# Altium schematic sheet Main.SchDoc
size A2; SheetNumber: 1; SheetTotal: 3
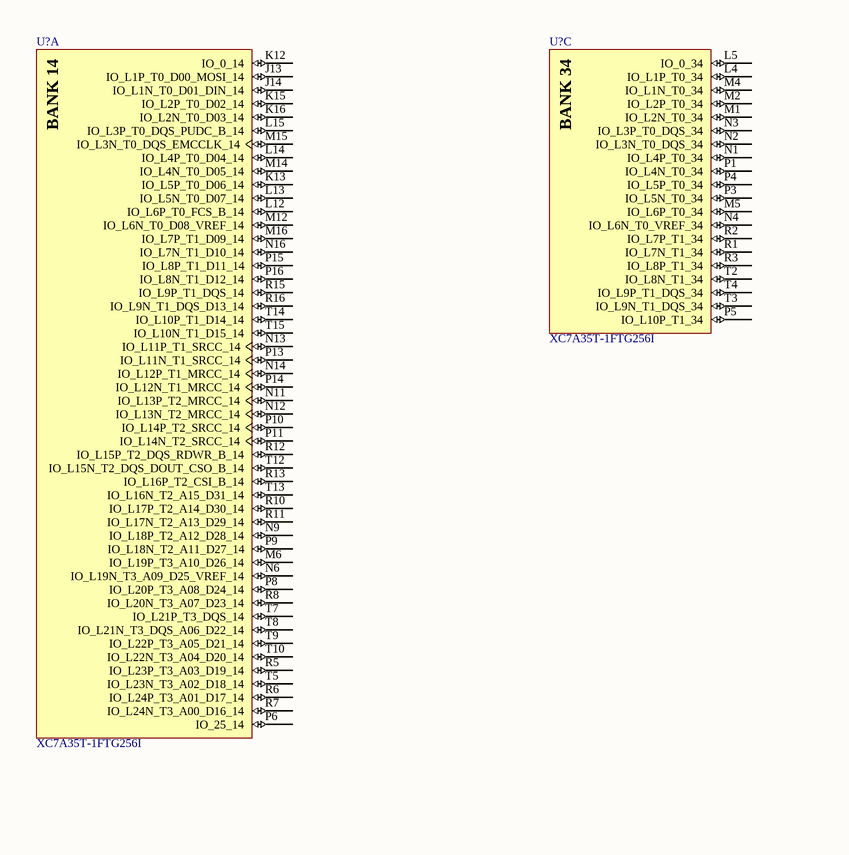
[diagram p0: Main.SchDoc, left]
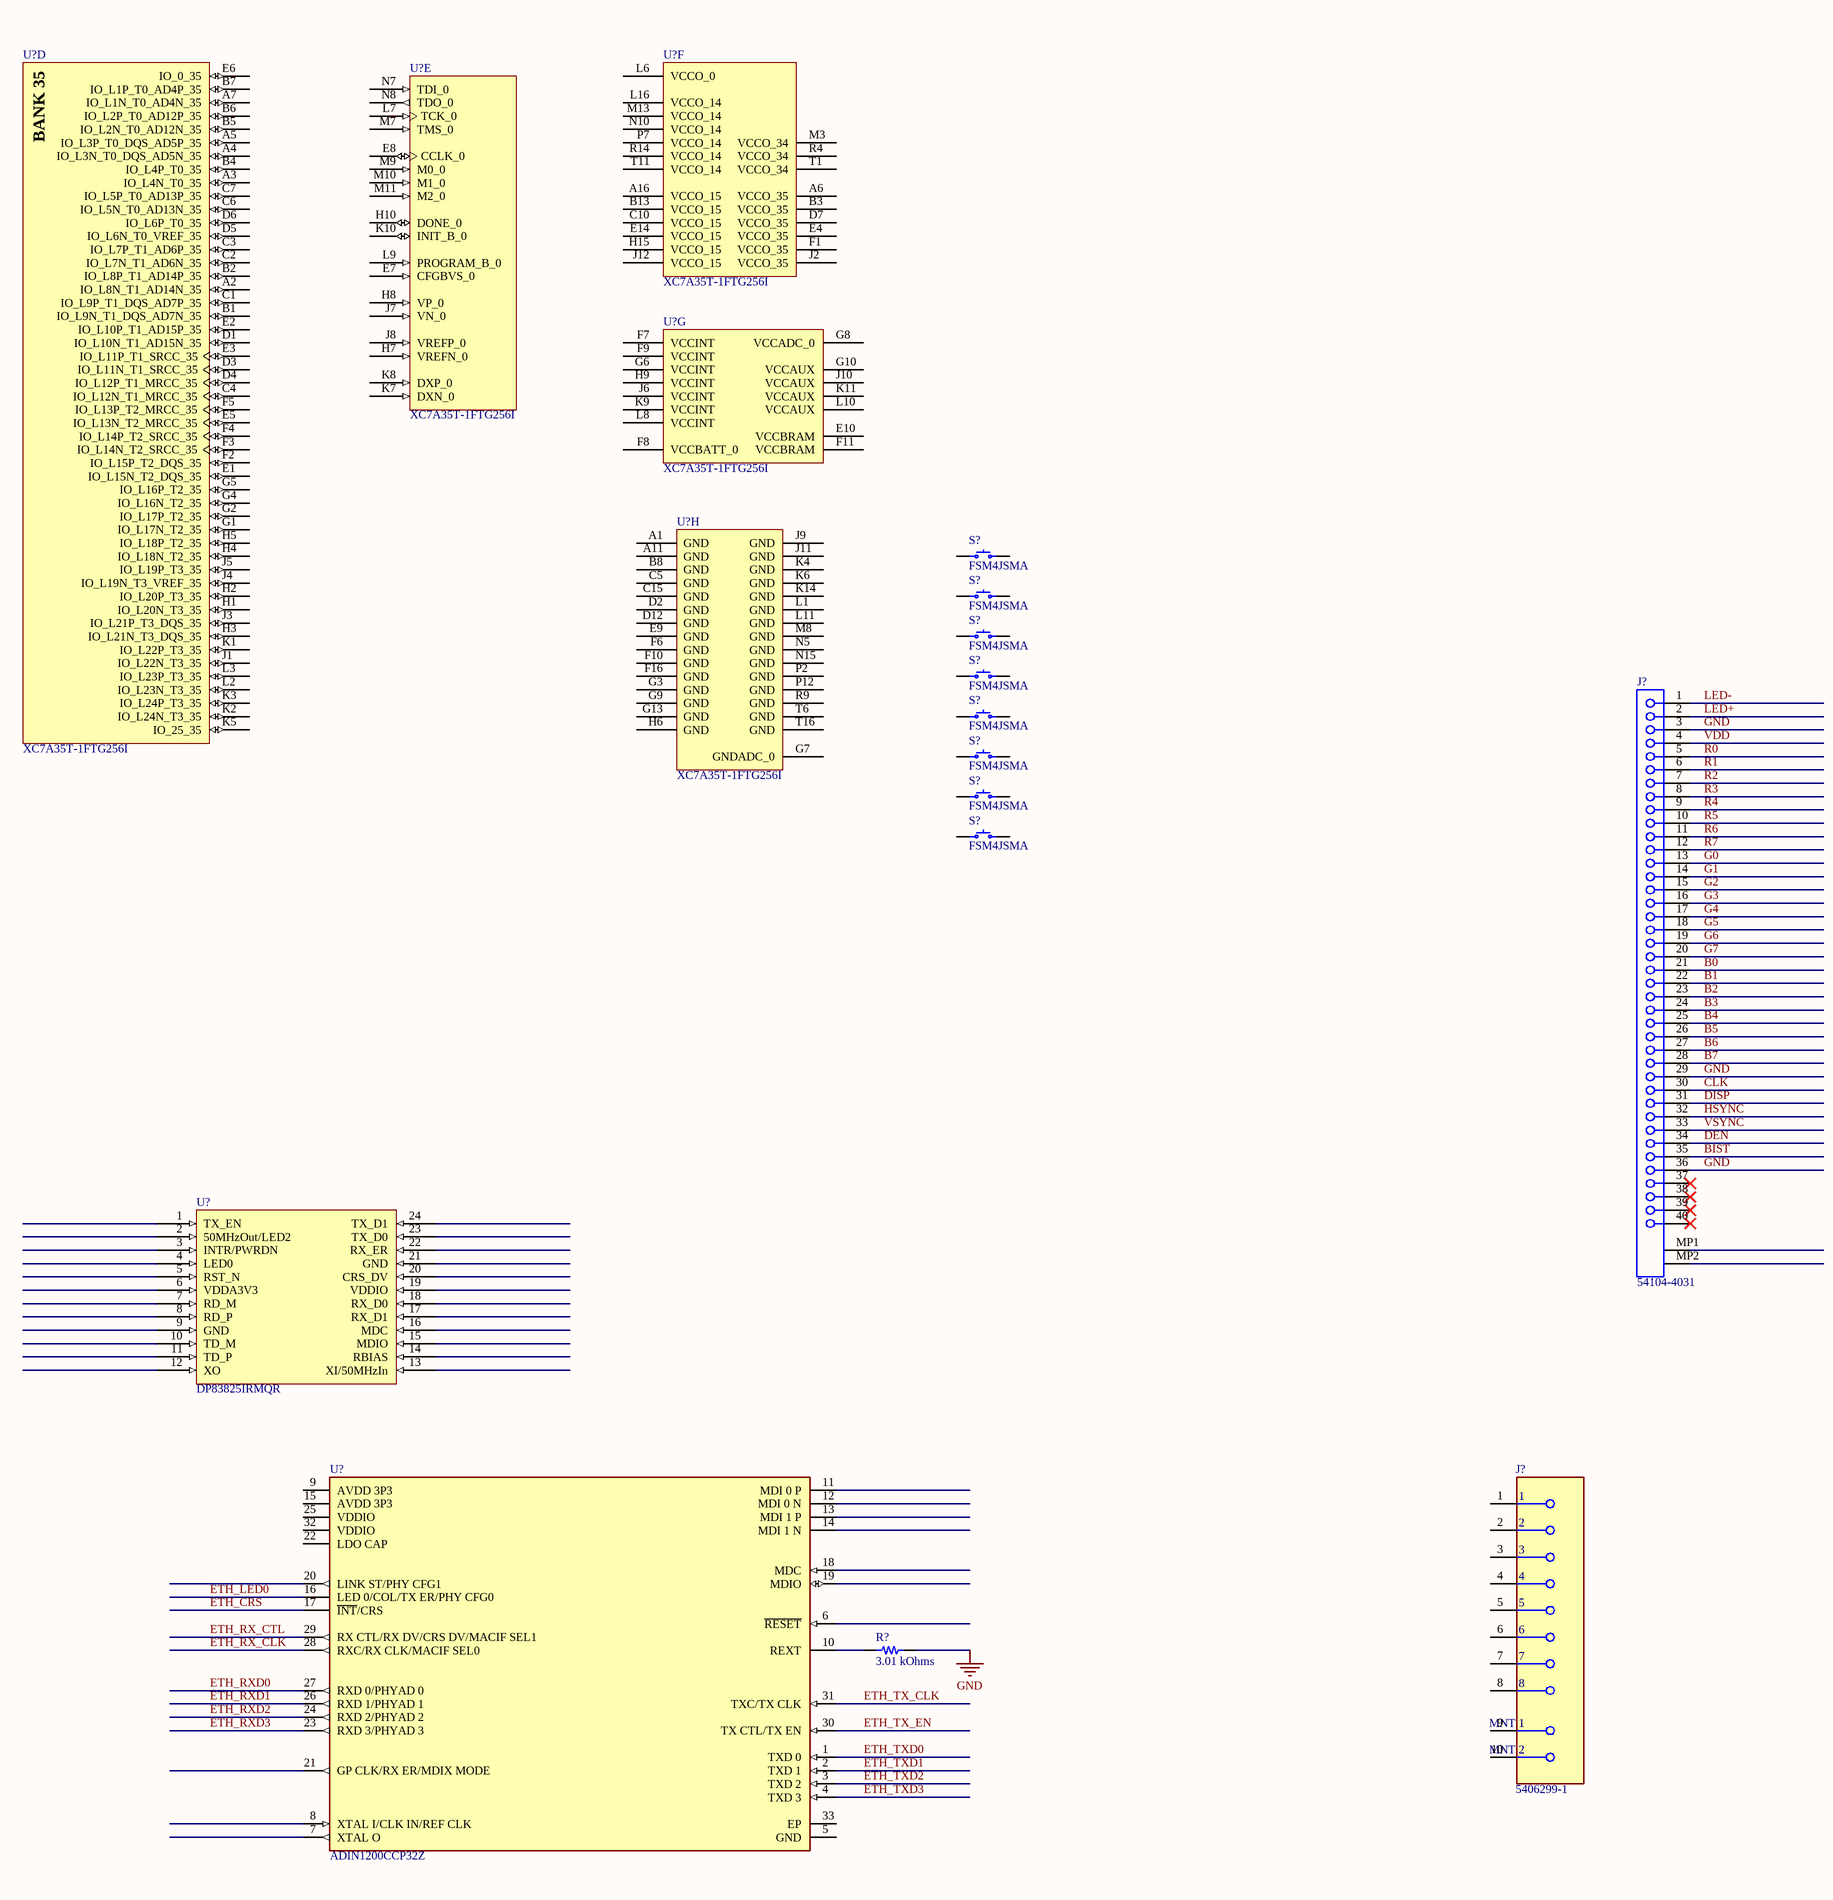
[diagram p1: Main.SchDoc, right]

## Parts
(Parts that share a designator on the sheet are numbered #1, #2 ... from top to bottom, then left to right.)
J?#1  54104-4031  [MOLX-54104-4031]
J?#2  5406299-1  [FP-5406299-1-MFG]
R?  3.01 kOhms  [RES 0603_1608]
S?#1  FSM4JSMA  [TE FSM4JSMA]
S?#2  FSM4JSMA  [TE FSM4JSMA]
S?#3  FSM4JSMA  [TE FSM4JSMA]
S?#4  FSM4JSMA  [TE FSM4JSMA]
S?#5  FSM4JSMA  [TE FSM4JSMA]
S?#6  FSM4JSMA  [TE FSM4JSMA]
S?#7  FSM4JSMA  [TE FSM4JSMA]
S?#8  FSM4JSMA  [TE FSM4JSMA]
U?#1  XC7A35T-1FTG256I  [FTG256]  (part A of 8)
U?#2  XC7A35T-1FTG256I  [FTG256]  (part C of 8)
U?#3  XC7A35T-1FTG256I  [FTG256]  (part D of 8)
U?#4  XC7A35T-1FTG256I  [FTG256]  (part F of 8)
U?#5  XC7A35T-1FTG256I  [FTG256]  (part E of 8)
U?#6  XC7A35T-1FTG256I  [FTG256]  (part G of 8)
U?#7  XC7A35T-1FTG256I  [FTG256]  (part H of 8)
U?#8  DP83825IRMQR
U?#9  ADIN1200CCP32Z  [FP-CP-32-31-MFG]

## Nets
GND: J?#1.3 J?#1.29 J?#1.36 R?.2
B0: J?#1.21
B1: J?#1.22
B2: J?#1.23
B3: J?#1.24
B4: J?#1.25
B5: J?#1.26
B6: J?#1.27
B7: J?#1.28
BIST: J?#1.35
CLK: J?#1.30
DEN: J?#1.34
DISP: J?#1.31
ETH_CRS: U?#9.17(~{INT}/CRS)
ETH_LED0: U?#9.16(LED_0/COL/TX_ER/PHY_CFG0)
ETH_RX_CLK: U?#9.28(RXC/RX_CLK/MACIF_SEL0)
ETH_RX_CTL: U?#9.29(RX_CTL/RX_DV/CRS_DV/MACIF_SEL1)
ETH_RXD0: U?#9.27(RXD_0/PHYAD_0)
ETH_RXD1: U?#9.26(RXD_1/PHYAD_1)
ETH_RXD2: U?#9.24(RXD_2/PHYAD_2)
ETH_RXD3: U?#9.23(RXD_3/PHYAD_3)
ETH_TX_CLK: U?#9.31(TXC/TX_CLK)
ETH_TX_EN: U?#9.30(TX_CTL/TX_EN)
ETH_TXD0: U?#9.1(TXD_0)
ETH_TXD1: U?#9.2(TXD_1)
ETH_TXD2: U?#9.3(TXD_2)
ETH_TXD3: U?#9.4(TXD_3)
G0: J?#1.13
G1: J?#1.14
G2: J?#1.15
G3: J?#1.16
G4: J?#1.17
G5: J?#1.18
G6: J?#1.19
G7: J?#1.20
HSYNC: J?#1.32
LED+: J?#1.2
LED-: J?#1.1
R0: J?#1.5
R1: J?#1.6
R2: J?#1.7
R3: J?#1.8
R4: J?#1.9
R5: J?#1.10
R6: J?#1.11
R7: J?#1.12
VDD: J?#1.4
VSYNC: J?#1.33
NetR?_1: R?.1 U?#9.10(REXT)
NetS?#1_1: S?#1.1 S?#1.2
NetS?#1_3: S?#1.3 S?#1.4
NetS?#2_1: S?#2.1 S?#2.2
NetS?#2_3: S?#2.3 S?#2.4
NetS?#3_1: S?#3.1 S?#3.2
NetS?#3_3: S?#3.3 S?#3.4
NetS?#4_1: S?#4.1 S?#4.2
NetS?#4_3: S?#4.3 S?#4.4
NetS?#5_1: S?#5.1 S?#5.2
NetS?#5_3: S?#5.3 S?#5.4
NetS?#6_1: S?#6.1 S?#6.2
NetS?#6_3: S?#6.3 S?#6.4
NetS?#7_1: S?#7.1 S?#7.2
NetS?#7_3: S?#7.3 S?#7.4
NetS?#8_1: S?#8.1 S?#8.2
NetS?#8_3: S?#8.3 S?#8.4

Not connected (* = marked no-connect by the designer): J?#1 37* 38* 39* 40* MP1 MP2; J?#2 1 2 3 4 5 6 7 8 9(MNT_1) 10(MNT_2); U?#1 J13(IO_L1P_T0_D00_MOSI_14) J14(IO_L1N_T0_D01_DIN_14) K12(IO_0_14) K13(IO_L5P_T0_D06_14) K15(IO_L2P_T0_D02_14) K16(IO_L2N_T0_D03_14) L12(IO_L6P_T0_FCS_B_14) L13(IO_L5N_T0_D07_14) L14(IO_L4P_T0_D04_14) L15(IO_L3P_T0_DQS_PUDC_B_14) M6(IO_L19P_T3_A10_D26_14) M12(IO_L6N_T0_D08_VREF_14) M14(IO_L4N_T0_D05_14) M15(IO_L3N_T0_DQS_EMCCLK_14) M16(IO_L7P_T1_D09_14) N6(IO_L19N_T3_A09_D25_VREF_14) N9(IO_L18P_T2_A12_D28_14) N11(IO_L13P_T2_MRCC_14) N12(IO_L13N_T2_MRCC_14) N13(IO_L11P_T1_SRCC_14) N14(IO_L12P_T1_MRCC_14) N16(IO_L7N_T1_D10_14) P6(IO_25_14) P8(IO_L20P_T3_A08_D24_14) P9(IO_L18N_T2_A11_D27_14) P10(IO_L14P_T2_SRCC_14) P11(IO_L14N_T2_SRCC_14) P13(IO_L11N_T1_SRCC_14) P14(IO_L12N_T1_MRCC_14) P15(IO_L8P_T1_D11_14) P16(IO_L8N_T1_D12_14) R5(IO_L23P_T3_A03_D19_14) R6(IO_L24P_T3_A01_D17_14) R7(IO_L24N_T3_A00_D16_14) R8(IO_L20N_T3_A07_D23_14) R10(IO_L17P_T2_A14_D30_14) R11(IO_L17N_T2_A13_D29_14) R12(IO_L15P_T2_DQS_RDWR_B_14) R13(IO_L16P_T2_CSI_B_14) R15(IO_L9P_T1_DQS_14) R16(IO_L9N_T1_DQS_D13_14) T5(IO_L23N_T3_A02_D18_14) T7(IO_L21P_T3_DQS_14) T8(IO_L21N_T3_DQS_A06_D22_14) T9(IO_L22P_T3_A05_D21_14) T10(IO_L22N_T3_A04_D20_14) T12(IO_L15N_T2_DQS_DOUT_CSO_B_14) T13(IO_L16N_T2_A15_D31_14) T14(IO_L10P_T1_D14_14) T15(IO_L10N_T1_D15_14); U?#2 L4(IO_L1P_T0_34) L5(IO_0_34) M1(IO_L2N_T0_34) M2(IO_L2P_T0_34) M4(IO_L1N_T0_34) M5(IO_L6P_T0_34) N1(IO_L4P_T0_34) N2(IO_L3N_T0_DQS_34) N3(IO_L3P_T0_DQS_34) N4(IO_L6N_T0_VREF_34) P1(IO_L4N_T0_34) P3(IO_L5N_T0_34) P4(IO_L5P_T0_34) P5(IO_L10P_T1_34) R1(IO_L7N_T1_34) R2(IO_L7P_T1_34) R3(IO_L8P_T1_34) T2(IO_L8N_T1_34) T3(IO_L9N_T1_DQS_34) T4(IO_L9P_T1_DQS_34); U?#3 A2(IO_L8N_T1_AD14N_35) A3(IO_L4N_T0_35) A4(IO_L3N_T0_DQS_AD5N_35) A5(IO_L3P_T0_DQS_AD5P_35) A7(IO_L1N_T0_AD4N_35) B1(IO_L9N_T1_DQS_AD7N_35) B2(IO_L8P_T1_AD14P_35) B4(IO_L4P_T0_35) B5(IO_L2N_T0_AD12N_35) B6(IO_L2P_T0_AD12P_35) B7(IO_L1P_T0_AD4P_35) C1(IO_L9P_T1_DQS_AD7P_35) C2(IO_L7N_T1_AD6N_35) C3(IO_L7P_T1_AD6P_35) C4(IO_L12N_T1_MRCC_35) C6(IO_L5N_T0_AD13N_35) C7(IO_L5P_T0_AD13P_35) D1(IO_L10N_T1_AD15N_35) D3(IO_L11N_T1_SRCC_35) D4(IO_L12P_T1_MRCC_35) D5(IO_L6N_T0_VREF_35) D6(IO_L6P_T0_35) E1(IO_L15N_T2_DQS_35) E2(IO_L10P_T1_AD15P_35) E3(IO_L11P_T1_SRCC_35) E5(IO_L13N_T2_MRCC_35) E6(IO_0_35) F2(IO_L15P_T2_DQS_35) F3(IO_L14N_T2_SRCC_35) F4(IO_L14P_T2_SRCC_35) F5(IO_L13P_T2_MRCC_35) G1(IO_L17N_T2_35) G2(IO_L17P_T2_35) G4(IO_L16N_T2_35) G5(IO_L16P_T2_35) H1(IO_L20N_T3_35) H2(IO_L20P_T3_35) H3(IO_L21N_T3_DQS_35) H4(IO_L18N_T2_35) H5(IO_L18P_T2_35) J1(IO_L22N_T3_35) J3(IO_L21P_T3_DQS_35) J4(IO_L19N_T3_VREF_35) J5(IO_L19P_T3_35) K1(IO_L22P_T3_35) K2(IO_L24N_T3_35) K3(IO_L24P_T3_35) K5(IO_25_35) L2(IO_L23N_T3_35) L3(IO_L23P_T3_35); U?#4 A6(VCCO_35) A16(VCCO_15) B3(VCCO_35) B13(VCCO_15) C10(VCCO_15) D7(VCCO_35) E4(VCCO_35) E14(VCCO_15) F1(VCCO_35) H15(VCCO_15) J2(VCCO_35) J12(VCCO_15) L6(VCCO_0) L16(VCCO_14) M3(VCCO_34) M13(VCCO_14) N10(VCCO_14) P7(VCCO_14) R4(VCCO_34) R14(VCCO_14) T1(VCCO_34) T11(VCCO_14); U?#5 E7(CFGBVS_0) E8(CCLK_0) H7(VREFN_0) H8(VP_0) H10(DONE_0) J7(VN_0) J8(VREFP_0) K7(DXN_0) K8(DXP_0) K10(INIT_B_0) L7(TCK_0) L9(PROGRAM_B_0) M7(TMS_0) M9(M0_0) M10(M1_0) M11(M2_0) N7(TDI_0) N8(TDO_0); U?#6 E10(VCCBRAM) F7(VCCINT) F8(VCCBATT_0) F9(VCCINT) F11(VCCBRAM) G6(VCCINT) G8(VCCADC_0) G10(VCCAUX) H9(VCCINT) J6(VCCINT) J10(VCCAUX) K9(VCCINT) K11(VCCAUX) L8(VCCINT) L10(VCCAUX); U?#7 A1(GND) A11(GND) B8(GND) C5(GND) C15(GND) D2(GND) D12(GND) E9(GND) F6(GND) F10(GND) F16(GND) G3(GND) G7(GNDADC_0) G9(GND) G13(GND) H6(GND) J9(GND) J11(GND) K4(GND) K6(GND) K14(GND) L1(GND) L11(GND) M8(GND) N5(GND) N15(GND) P2(GND) P12(GND) R9(GND) T6(GND) T16(GND); U?#8 1(TX_EN) 2(50MHzOut/LED2) 3(INTR/PWRDN) 4(LED0) 5(RST_N) 6(VDDA3V3) 7(RD_M) 8(RD_P) 9(GND) 10(TD_M) 11(TD_P) 12(XO) 13(XI/50MHzIn) 14(RBIAS) 15(MDIO) 16(MDC) 17(RX_D1) 18(RX_D0) 19(VDDIO) 20(CRS_DV) 21(GND) 22(RX_ER) 23(TX_D0) 24(TX_D1); U?#9 5(GND) 6(~{RESET}) 7(XTAL_O) 8(XTAL_I/CLK_IN/REF_CLK) 9(AVDD_3P3) 11(MDI_0_P) 12(MDI_0_N) 13(MDI_1_P) 14(MDI_1_N) 15(AVDD_3P3) 18(MDC) 19(MDIO) 20(LINK_ST/PHY_CFG1) 21(GP_CLK/RX_ER/MDIX_MODE) 22(LDO_CAP) 25(VDDIO) 32(VDDIO) 33(EP)

## Notes on the sheet
- (in symbol CMP-0383-00026-1, part A) BANK 14
- (in symbol CMP-0383-00026-1, part C) BANK 34
- (in symbol CMP-0383-00026-1, part D) BANK 35

## Library data of the parts
J?#1 = CMP-1241-00508-1: 0.5 mm Pitch Easy-On(TM) Type FPC Connector, 2.0 mm Mated Height, Right Angle, ZIF, SMT, Top Contact, 40 Circuits, -20 to 85 degC, ELV and RoHS Compliant, Tape and Reel; Manufacturer: Molex; PCB Retention: Yes; Current (Max per Contact): 0.5A; Stackable: No; Durability (mating cycles max): 20; Pitch - Mating Interface: 0.50mm; Circuits (Loaded): 40; Mated Height: 2.00mm; Entry Angle: 90degrees Angle; Material - Metal: Phosphor Bronze; Voltage (Max): 50V; ComponentLink3URL: http://www.molex.com/pdm_docs/sd/541044031_sd.pdf; ComponentLink2URL: http://www.molex.com/webdocs/datasheets/pdf/en-us/0541044031_FFC_FPC_CONNECTORS.pdf; Number of Rows: 1; ComponentLink1Description: Manufacturer URL; ComponentLink2Description: Datasheet; Mounting Technology: Surface Mount; ComponentLink1URL: http://www.molex.com/molex/index.jsp; RoHS: TRUE; PackageReference: 54104-4031; Polarized to PCB: Yes; ComponentLink3Description: Package Specification; PackageVersion: Rev. F, 06/2012; PackageDescription: 40-Lead FPC Connector, Pitch 0.5 mm; Contact Position: Top; PCB Locator: No; PartNumber: 54104-4031; Orientation: Right Angle; Packing: Tape and Reel
J?#2 = CMP-03371-000007-1: CONN MOD JACK 8P8C R/A SHIELDED; Manufacturer: TE Connectivity; Current Rating: 1.5A; Number Of Contacts: 8; Description: Jack Modular Connector 8p8c (RJ45, Ethernet) 90° Angle (Right) Shielded, EMI Finger Cat5; Pitch: 1.27mm; Is Female: yes; Shielding: true; Voltage Rating: 150V; Conn Orientation: Right Angle; Conn Gender: Female; Contact Material: Gold,Nickel; Temperature Range Low: -40°C; Height: 14.73mm; Category: Conn; ComponentLink2URL: https://www.te.com/usa-en/product-5406299-1.html?te_bu=Cor&te_type=other&te_campaign=oct_glo_cor-oct-global-oth-prtnr-fy19-oct-octo-buy-bom_sma-298_2&elqCampaignId=35216; Package: 5406299-1; Lead Free: Yes; Octopart: https://octopart.com/5406299-1-te+connectivity-40212272; Digikey Description: CONN MOD JACK 8P8C R/A SHIELDED; ComponentLink2Description: Datasheet; Automotive: No; Device Class L1: Connectors; Temperature Range High: +85°C; Mouser Description: Conn RJ-45 F 8 POS 2.54mm Solder RA Thru-Hole 8 Terminal 1 Port Cat 5 Box/Tray; RoHS: TRUE; Manufacturer Part Number: 5406299-1; Temperature: -40°C to +85°C; Device Class L2: Modular / Ethernet Connectors; Device Class L3: unset
R? = ERJ-PB3D3011V: RES SMD 3.01K OHM 0.5% 1/5W 0603; Manufacturer: Panasonic Electronic Components; Power (Watts): 0.2W, 1/5W; Temperature Coefficient: ±50ppm/°C; Part Number: ERJ-PB3D3011V; Value: 3.01 kOhms; ComponentLink1Description: Datasheet; ComponentLink1URL: https://industrial.panasonic.com/cdbs/www-data/pdf/RDM0000/AOA0000C328.pdf; ComponentLink2Description: DigiKey Link; ComponentLink2URL: http://digikey.com/product-detail/en/panasonic-electronic-components/ERJ-PB3D3011V/P20336CT-ND/6214591; Composition: Thick Film; Device Package: 0603 (1608 Metric); Features: Automotive AEC-Q200, Pulse Withstanding; Height - Seated (Max): 0.022" (0.55mm); LastUpdated: 9/2/2020 1:09:38 AM; Lifecycle Status: Active; Minimum Order: 1; Number of Terminations: 2; Operating Temperature: -55°C ~ 155°C; Package / Case: 0603 (1608 Metric); Packaging: TapeAndReel; PartId: 24334; Part Status: Active; Price: 0.02; Ratings: AEC-Q200; Resistance: 3.01 kOhms; Series: ERJ; Size / Dimension: 0.063" L x 0.031" W (1.60mm x 0.80mm); Supplier 1: DigiKey; Supplier Part Number 1: P20336CT-ND; Supplier Device Package: 0603; Tolerance: ±0.5%
S?#1-S?#8 = FSM4JSMA: SWITCH TACTILE SPST-NO 0.05A 24V; Manufacturer: TE Connectivity ALCOSWITCH Switches; Actuator Height off PCB, Vertical: 5.00mm; Actuator Orientation: Top Actuated; Actuator Type: Standard; Contact Rating @ Voltage: 0.05A @ 24VDC; Illumination: Non-Illuminated; Operating Force: 160gf; Outline: 6.00mm x 6.00mm; Switch Function: Off-Mom; Part Number: FSM4JSMA; Circuit: SPST-NO; ComponentLink1Description: Datasheet; ComponentLink1URL: https://www.te.com/commerce/DocumentDelivery/DDEController?Action=srchrtrv&DocNm=1308111-1_SWITCHES_CORE_PROGRAM_CATALOG&DocType=CS&DocLang=English; ComponentLink2Description: DigiKey Link; ComponentLink2URL: http://digikey.com/product-detail/en/te-connectivity-alcoswitch-switches/FSM4JSMA/450-1129-ND/525821; LastUpdated: 9/2/2020 1:27:07 AM; Lifecycle Status: Active; Minimum Order: 1; Mounting Type: Surface Mount; Operating Temperature: -35°C ~ 85°C; Packaging: Bulk; Part Status: Active; Price: 0.23; Series: FSMJSMA; Supplier 1: DigiKey; Supplier Part Number 1: 450-1129-ND; Termination Style: Gull Wing
U?#1-U?#7 = CMP-0383-00026-1: Artix-7 FPGA, 170 User I/Os, 0 GTP, 256-Ball BGA, Speed Grade 1, Industrial Grade, Pb-Free; Manufacturer: Xilinx; Speed Grades: 1; Logic Cells: 33280; Available User I/O: 170; CMTs: 5; GTP: 0; Total Block RAM: 1800 Kb; ComponentLink3Description: Pinout; ComponentLink2Description: Datasheet; ComponentLink1Description: Manufacturer URL; DatasheetVersion: Rev. 1.15; ComponentLink4URL: http://www.xilinx.com/support/documentation/user_guides/ug475_7Series_Pkg_Pinout.pdf; ComponentLink4Description: Package Specification; ComponentLink1URL: http://www.xilinx.com/; PackageReference: FTG-256; Maximum Distributed RAM: 400 Kb; PartNumber: XC7A35T-1FTG256I; ComponentLink2URL: http://www.xilinx.com/support/documentation/data_sheets/ds180_7Series_Overview.pdf; Mounting Technology: Surface Mount; Operating Temperature Range: Industrial; PackageVersion: Rev. 1.11; ComponentLink3URL: http://www.xilinx.com/support/documentation/user_guides/ug475_7Series_Pkg_Pinout.pdf; PackageDescription: 256-Ball Wire-Bond Fine-Pitch Thin BGA, Body 17 x 17 mm, Pitch 1 mm
U?#8 = DP83825IRMQR: Manufacturer: Texas Instruments; Supplier 1: Digi-Key; Manufacturer Part Number: DP83825IRMQR; RoHS: Yes; Category: Interface ICs; Stock 1: 2260; Pricing 1: 1=1.40000, 10=1.25100, 25=1.18720, 100=0.91160, 250=0.80560, 500=0.76320, 1000=0.59360 (USD); Supplier Part Number 1: 296-DP83825IRMQRCT-ND
U?#9 = CMP-09095-000001-1: INDUSTRIAL ETHERNET GIGABIT PHY; Manufacturer: Analog Devices; Nominal Supply Current: 20-31mA; Data Rate: 100Mbits/s; Standoff Height: 0.02mm; Description: 4/4 Transceiver Full, Half Ethernet, IEEE 802.3, MII, RMII, PHY2 32-LFCSP (5x5); Max Junction Temp: +125°C; Min Supply Voltage: 1.71V; Simplex Duplex: Full Duplex; Max Supply Voltage: 3.46V; Number Of Channels: 4; ComponentLink2URL: https://www.analog.com/media/en/technical-documentation/data-sheets/ADIN1200.pdf; Height: 0.8mm; Automotive: No; RoHS: TRUE; Digikey Description: INDUSTRIAL ETHERNET GIGABIT PHY; Package: CP-32-31; Octopart: https://octopart.com/adin1200ccp32z-analog+devices-103760365; Device Class L3: Ethernet Interface ICs; Interface: Ethernet; Temperature: -40°C to +105°C; Category: IC; Lead Free: Yes; Device Class L2: Interface ICs; Ipc Land Pattern Name: QFN50P500X500X75-32; Ambient Temperature Range High: +105°C; Manufacturer Part Number: ADIN1200CCP32Z; Device Class L1: Integrated Circuits (ICs); ComponentLink2Description: Datasheet; Footprint Url: https://forum.upverter.com/uploads/short-url/dN8iC8CK9Ps5z8gUJcfltSaVrDQ.pdf; Temperature Range High: +105°C; Ambient Temperature Range Low: -40°C; Temperature Range Low: -40°C